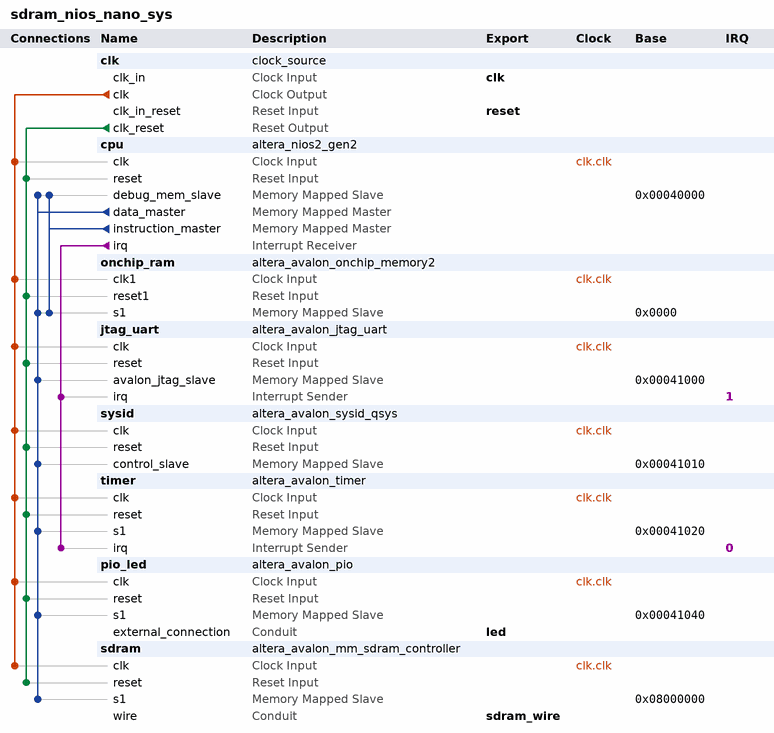
[diagram p0: system contents]
# Platform Designer (Qsys) system sdram_nios_nano_sys, Cyclone IV E EP4CE22F17C6
# Parameters at their usual value, and those the tool derives, are not listed.
package require -exact qsys 18.1
create_system sdram_nios_nano_sys
set_project_property DEVICE_FAMILY {Cyclone IV E}
set_project_property DEVICE EP4CE22F17C6

add_instance clk clock_source 18.1
set_instance_parameter_value clk clockFrequency 100000000
set_instance_parameter_value clk resetSynchronousEdges DEASSERT

add_instance cpu altera_nios2_gen2 18.1
set_instance_parameter_value cpu dcache_size 1024
set_instance_parameter_value cpu exceptionSlave onchip_ram.s1
set_instance_parameter_value cpu icache_size 2048
set_instance_parameter_value cpu impl Fast
set_instance_parameter_value cpu mul_32_impl 1
set_instance_parameter_value cpu resetSlave onchip_ram.s1

add_instance onchip_ram altera_avalon_onchip_memory2 18.1
set_instance_parameter_value onchip_ram dataWidth 32
set_instance_parameter_value onchip_ram dualPort false
set_instance_parameter_value onchip_ram initMemContent true
set_instance_parameter_value onchip_ram initializationFileName onchip_mem.hex
set_instance_parameter_value onchip_ram memorySize 32768
set_instance_parameter_value onchip_ram singleClockOperation true

add_instance jtag_uart altera_avalon_jtag_uart 18.1
set_instance_parameter_value jtag_uart simInteractiveOptions NO_INTERACTIVE_WINDOWS

add_instance sysid altera_avalon_sysid_qsys 18.1
set_instance_parameter_value sysid id -559038736

add_instance timer altera_avalon_timer 18.1
set_instance_parameter_value timer period 1
set_instance_parameter_value timer periodUnits MSEC

add_instance pio_led altera_avalon_pio 18.1
set_instance_parameter_value pio_led direction Output
set_instance_parameter_value pio_led width 8

add_instance sdram altera_avalon_mm_sdram_controller 1.0
set_instance_parameter_value sdram ADDR_MAP 0
set_instance_parameter_value sdram BANK_BITS 2
set_instance_parameter_value sdram CAS_LAT 3
set_instance_parameter_value sdram COL_BITS 9
set_instance_parameter_value sdram DATA_BITS 16
set_instance_parameter_value sdram FIFO_DEPTH 8
set_instance_parameter_value sdram INIT_REFS 8
set_instance_parameter_value sdram LOOKAHEAD 1
set_instance_parameter_value sdram RD_EXTRA_LAT 0
set_instance_parameter_value sdram REF_MAX_PEND 8
set_instance_parameter_value sdram REF_PERIOD_MS 64
set_instance_parameter_value sdram REF_ROWS 8192
set_instance_parameter_value sdram ROW_BITS 13
set_instance_parameter_value sdram SA_BITS 13
set_instance_parameter_value sdram T_INIT_US 100
set_instance_parameter_value sdram T_MRD_NS 15.0
set_instance_parameter_value sdram T_RAS_NS 45.0
set_instance_parameter_value sdram T_RCD_NS 20.0
set_instance_parameter_value sdram T_RC_NS 67.5
set_instance_parameter_value sdram T_RFC_NS 67.5
set_instance_parameter_value sdram T_RP_NS 20.0
set_instance_parameter_value sdram T_RRD_NS 14.0
set_instance_parameter_value sdram T_WR_NS 14.0
set_instance_parameter_value sdram WR_TURNAROUND_EXTRA 0

# connections
add_connection clk.clk cpu.clk clock
add_connection clk.clk jtag_uart.clk clock
add_connection clk.clk onchip_ram.clk1 clock
add_connection clk.clk pio_led.clk clock
add_connection clk.clk sdram.clk clock
add_connection clk.clk sysid.clk clock
add_connection clk.clk timer.clk clock
add_connection clk.clk_reset cpu.reset reset
add_connection clk.clk_reset jtag_uart.reset reset
add_connection clk.clk_reset onchip_ram.reset1 reset
add_connection clk.clk_reset pio_led.reset reset
add_connection clk.clk_reset sdram.reset reset
add_connection clk.clk_reset sysid.reset reset
add_connection clk.clk_reset timer.reset reset
add_connection cpu.data_master cpu.debug_mem_slave avalon
set_connection_parameter_value cpu.data_master/cpu.debug_mem_slave baseAddress 0x00040000
add_connection cpu.data_master jtag_uart.avalon_jtag_slave avalon
set_connection_parameter_value cpu.data_master/jtag_uart.avalon_jtag_slave baseAddress 0x00041000
add_connection cpu.data_master onchip_ram.s1 avalon
set_connection_parameter_value cpu.data_master/onchip_ram.s1 baseAddress 0x0000
add_connection cpu.data_master pio_led.s1 avalon
set_connection_parameter_value cpu.data_master/pio_led.s1 baseAddress 0x00041040
add_connection cpu.data_master sdram.s1 avalon
set_connection_parameter_value cpu.data_master/sdram.s1 baseAddress 0x08000000
add_connection cpu.data_master sysid.control_slave avalon
set_connection_parameter_value cpu.data_master/sysid.control_slave baseAddress 0x00041010
add_connection cpu.data_master timer.s1 avalon
set_connection_parameter_value cpu.data_master/timer.s1 baseAddress 0x00041020
add_connection cpu.instruction_master cpu.debug_mem_slave avalon
set_connection_parameter_value cpu.instruction_master/cpu.debug_mem_slave baseAddress 0x00040000
add_connection cpu.instruction_master onchip_ram.s1 avalon
set_connection_parameter_value cpu.instruction_master/onchip_ram.s1 baseAddress 0x0000
add_connection cpu.irq jtag_uart.irq interrupt
set_connection_parameter_value cpu.irq/jtag_uart.irq irqNumber 1
add_connection cpu.irq timer.irq interrupt
set_connection_parameter_value cpu.irq/timer.irq irqNumber 0

# exported interfaces
add_interface clk clock sink
set_interface_property clk EXPORT_OF clk.clk_in
add_interface led conduit end
set_interface_property led EXPORT_OF pio_led.external_connection
add_interface reset reset sink
set_interface_property reset EXPORT_OF clk.clk_in_reset
add_interface sdram_wire conduit end
set_interface_property sdram_wire EXPORT_OF sdram.wire

set_interconnect_requirement {$system} qsys_mm.clockCrossingAdapter HANDSHAKE
set_interconnect_requirement {$system} qsys_mm.enableEccProtection FALSE
set_interconnect_requirement {$system} qsys_mm.insertDefaultSlave FALSE
set_interconnect_requirement {$system} qsys_mm.maxAdditionalLatency 1

save_system sdram_nios_nano_sys.qsys
